# Altium schematic sheet 16gpio_misc.SchDoc
size B
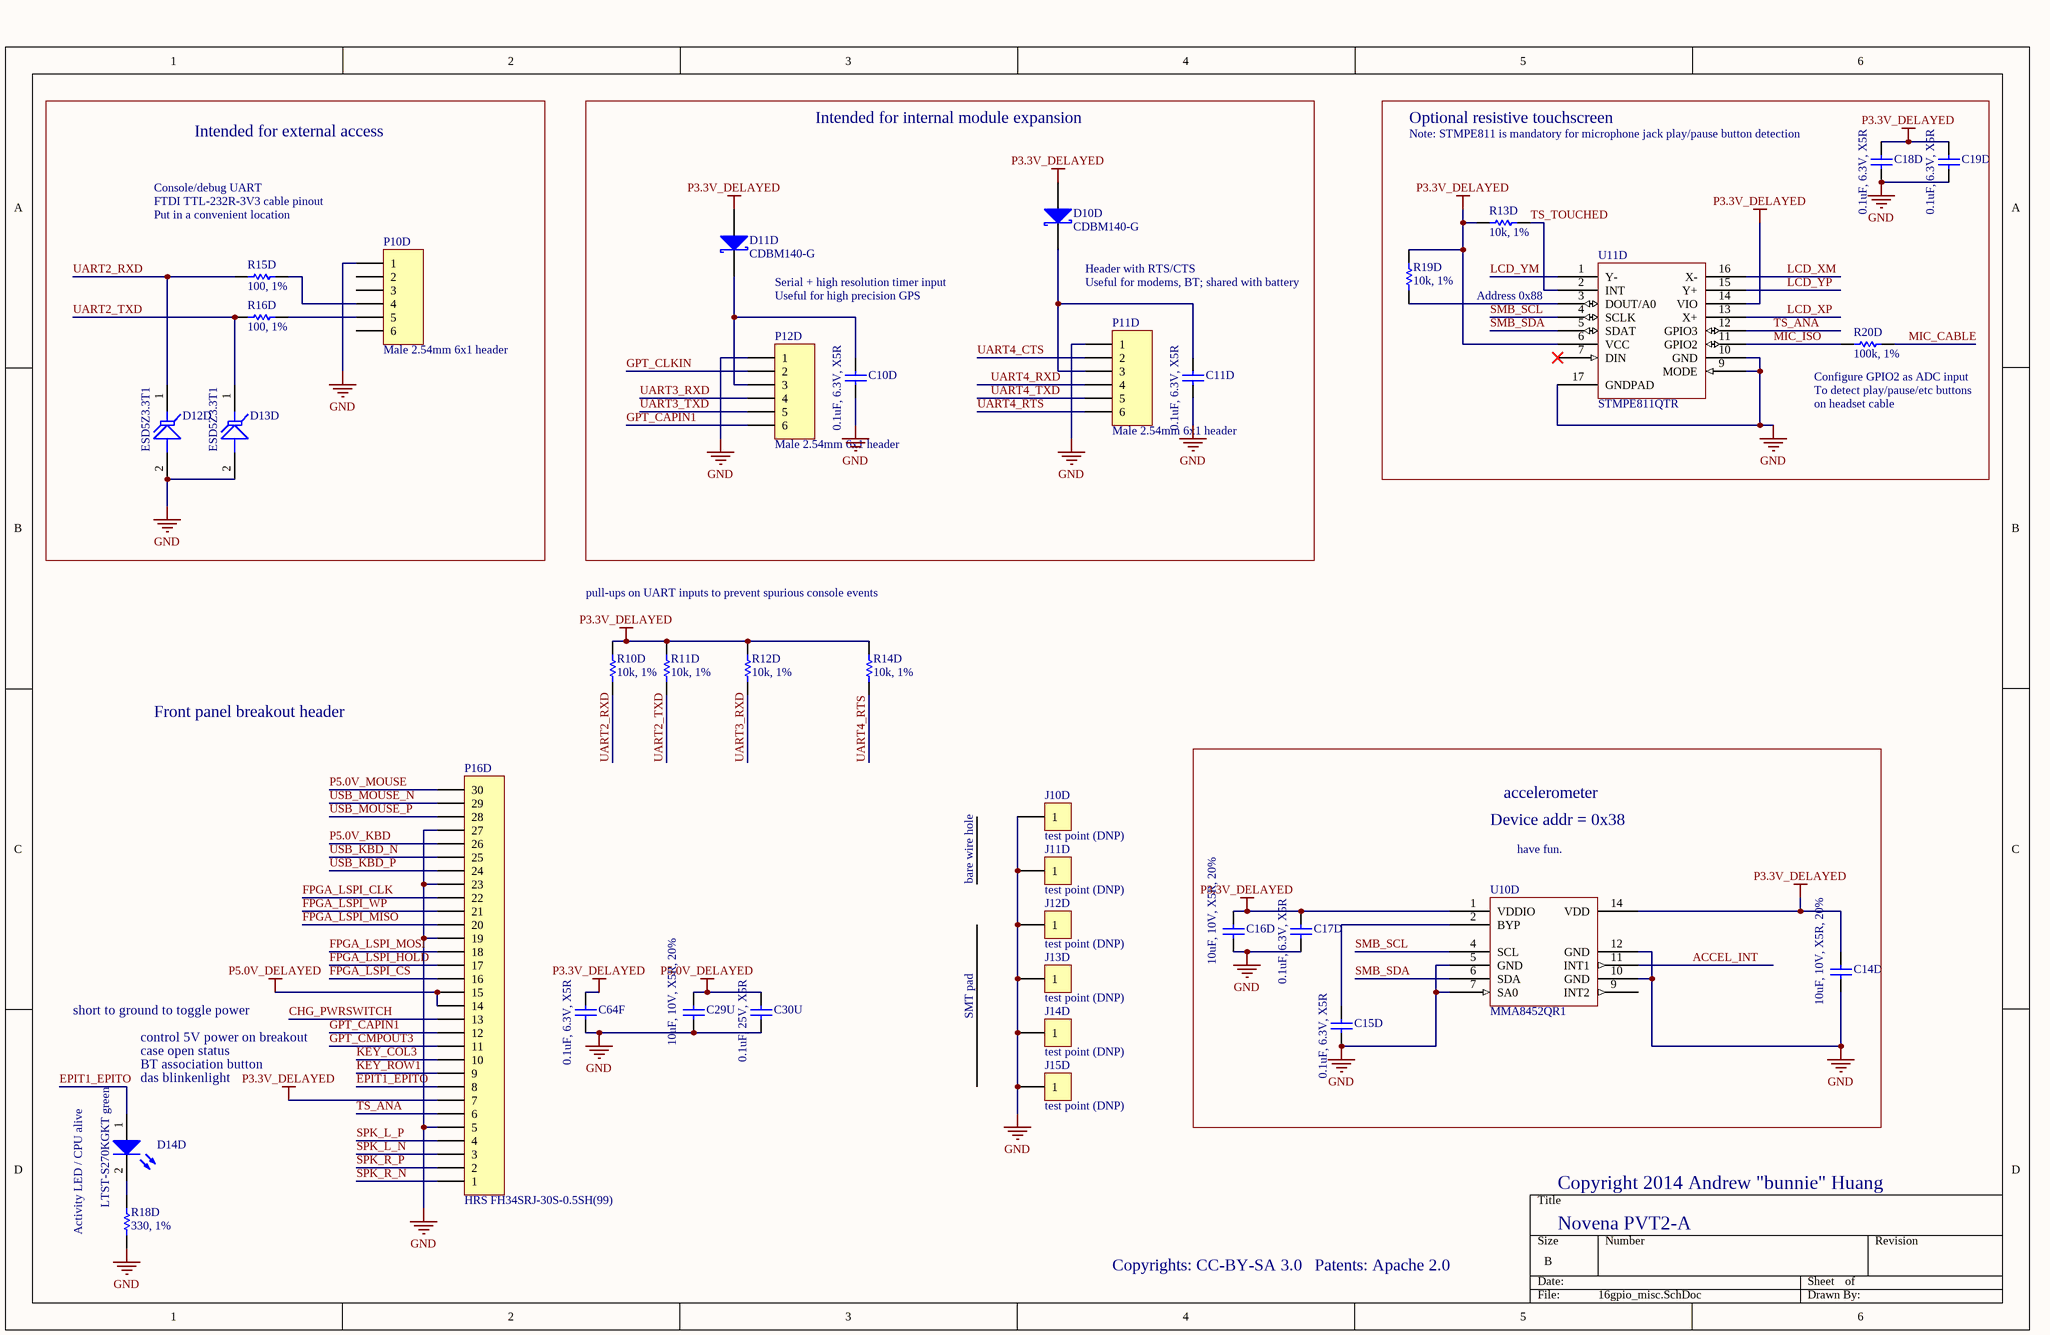
[diagram p0: 16gpio_misc.SchDoc]

## Parts
C10D  0.1uF, 6.3V, X5R  [CAPC0603N_B]
C11D  0.1uF, 6.3V, X5R  [CAPC0603N_B]
C14D  10uF, 10V, X5R, 20%  [CAPC1608N]
C15D  0.1uF, 6.3V, X5R  [CAPC0603N_B]
C16D  10uF, 10V, X5R, 20%  [CAPC1608N]
C17D  0.1uF, 6.3V, X5R  [CAPC0603N_B]
C18D  0.1uF, 6.3V, X5R  [CAPC0603N_B]
C19D  0.1uF, 6.3V, X5R  [CAPC0603N_B]
C29U  10uF, 10V, X5R, 20%  [CAPC1608N]
C30U  0.1uF, 25V, X5R  [CAPC1005N]
C64F  0.1uF, 6.3V, X5R  [CAPC0603N_B]
D10D  CDBM140-G  [SOD123]
D11D  CDBM140-G  [SOD123]
D12D  ESD5Z3.3T1  [SOD-523]
D13D  ESD5Z3.3T1  [SOD-523]
D14D  LTST-S270KGKT green  [CD1608-0603]
J10D  test point (DNP)  [TP_HOLE]
J11D  test point (DNP)  [TP_HOLE]
J12D  test point (DNP)  [TP_SMT_38mil]
J13D  test point (DNP)  [TP_SMT_38mil]
J14D  test point (DNP)  [TP_SMT_38mil]
J15D  test point (DNP)  [TP_SMT_38mil]
P10D  Male 2.54mm 6x1 header  [HDR1X6]
P11D  Male 2.54mm 6x1 header  [HDR1X6]
P12D  Male 2.54mm 6x1 header  [HDR1X6]
P16D  HRS FH34SRJ-30S-0.5SH(99)  [HRS_FH34SRJ-30S-0.5SH]
R10D  10k, 1%  [RESC1005N]
R11D  10k, 1%  [RESC1005N]
R12D  10k, 1%  [RESC1005N]
R13D  10k, 1%  [RESC1005N]
R14D  10k, 1%  [RESC1005N]
R15D  100, 1%  [RESC1005N]
R16D  100, 1%  [RESC1005N]
R18D  330, 1%  [RESC1005N]
R19D  10k, 1%  [RESC1005N]
R20D  100k, 1%  [RESC1005N]
U10D  MMA8452QR1  [FSC_QFN_3x3x1_16_2077-02]
U11D  STMPE811QTR  [QFN50P300X300-16V2N]

## Blocks framed on the sheet
Intended for external access: D12D D13D P10D R15D R16D
Intended for internal module expansion: C10D C11D D10D D11D P11D P12D
Optional resistive touchscreen: C18D C19D R13D R19D R20D U11D

## Nets
GND: C10D.2 C11D.2 C14D.2 C15D.2 C16D.2 C17D.2 C18D.2 C19D.2 C29U.2 C30U.2 C64F.2 D12D.2(A) D13D.2(A) J10D.1 J11D.1 J12D.1 J13D.1 J14D.1 J15D.1 P10D.1 P11D.1 P12D.1 P16D.5 P16D.19 P16D.23 P16D.27 R18D.1 U10D.5(GND) U10D.7(SA0) U10D.10(GND) U10D.12(GND) U11D.9(MODE) U11D.10(GND) U11D.17(GNDPAD)
P3.3V_DELAYED: C14D.1 C16D.1 C17D.1 C18D.1 C19D.1 C64F.1 D10D.1(A) D11D.1(A) P16D.7 R10D.1 R11D.1 R12D.1 R13D.2 R14D.1 R19D.1 U10D.1(VDDIO) U10D.14(VDD) U11D.6(VCC) U11D.14(VIO)
P5.0V_DELAYED: C29U.1 C30U.1 P16D.14 P16D.15
ACCEL_INT: U10D.11(INT1)
CHG_PWRSWITCH: P16D.13
EPIT1_EPITO: D14D.1(A) P16D.8
FPGA_LSPI_CLK: P16D.22
FPGA_LSPI_CS: P16D.16
FPGA_LSPI_HOLD: P16D.17
FPGA_LSPI_MISO: P16D.20
FPGA_LSPI_MOSI: P16D.18
FPGA_LSPI_WP: P16D.21
GPT_CAPIN1: P12D.6 P16D.12
GPT_CLKIN: P12D.2
GPT_CMPOUT3: P16D.11
KEY_COL3: P16D.10
KEY_ROW1: P16D.9
LCD_XM: U11D.16(X-)
LCD_XP: U11D.13(X+)
LCD_YM: U11D.1(Y-)
LCD_YP: U11D.15(Y+)
MIC_CABLE: R20D.2
MIC_ISO: R20D.1 U11D.11(GPIO2)
P5.0V_KBD: P16D.26
P5.0V_MOUSE: P16D.30
SMB_SCL: U10D.4(SCL) U11D.4(SCLK)
SMB_SDA: U10D.6(SDA) U11D.5(SDAT)
SPK_L_N: P16D.3
SPK_L_P: P16D.4
SPK_R_N: P16D.1
SPK_R_P: P16D.2
TS_ANA: P16D.6 U11D.12(GPIO3)
TS_TOUCHED: R13D.1 U11D.2(INT)
UART2_RXD: D12D.1(K) R10D.2 R15D.2
UART2_TXD: D13D.1(K) R11D.2 R16D.2
UART3_RXD: P12D.4 R12D.2
UART3_TXD: P12D.5
UART4_CTS: P11D.2
UART4_RTS: P11D.6 R14D.2
UART4_RXD: P11D.4
UART4_TXD: P11D.5
USB_KBD_N: P16D.25
USB_KBD_P: P16D.24
USB_MOUSE_N: P16D.29
USB_MOUSE_P: P16D.28
NetC10D_1: C10D.1 D11D.2(K) P12D.3
NetC11D_1: C11D.1 D10D.2(K) P11D.3
NetC15D_1: C15D.1 U10D.2(BYP)
NetD14D_2: D14D.2(K) R18D.2
NetP10D_4: P10D.4 R15D.1
NetP10D_5: P10D.5 R16D.1
NetR19D_2: R19D.2 U11D.3(DOUT/A0)

Not connected (* = marked no-connect by the designer): P10D 2 3 6; U10D 9(INT2); U11D 7(DIN)*

## Notes on the sheet
- (near C18D) Note: STMPE811 is mandatory for microphone jack play/pause button detection
- FTDI TTL-232R-3V3 cable pinout
- Console/debug UART
- Put in a convenient location
- Header with RTS/CTS
- Serial + high resolution timer input
- Useful for high precision GPS
- Useful for modems, BT; shared with battery
- Address 0x88
- (near R20D) Configure GPIO2 as ADC input
- (near R20D) To detect play/pause/etc buttons
- on headset cable
- pull-ups on UART inputs to prevent spurious console events
- Front panel breakout header
- accelerometer
- bare wire hole
- Device addr = 0x38
- have fun.
- short to ground to toggle power
- SMT pad
- das blinkenlight
- BT association button
- case open status
- control 5V power on breakout
- Copyright 2014 Andrew "bunnie" Huang
- Activity LED / CPU alive
- Copyrights: CC-BY-SA 3.0
- Patents: Apache 2.0
- Novena PVT2-A

## Library data of the parts
C10D C11D C14D C15D C16D C17D C18D C19D C29U C30U C64F = Cap Semi: Capacitor (Semiconductor SIM Model); Published: 8-Jun-2000; LatestRevisionDate: 17-Jul-2002; LatestRevisionNote: Re-released for DXP Platform.; PackageReference: C1206; Publisher: Altium Limited
D10D D11D = D Schottky: Schottky Diode; Code - JEDEC: DO-214-AA; Published: 8-Jun-2000; Publisher: Altium Limited; Revision: July-2002: Re-released for DXP Platform.
D12D D13D = Tranzorb: On Semi 3.3V standoff TVS diode; Published: 24-Mar-1999; LatestRevisionDate: 17-Jul-2002; LatestRevisionNote: Re-released for DXP Platform.; PackageReference: DO-7; Publisher: Altium Limited
D14D = LED2: Green R/A LED, 0603 package; Published: 8-Jun-2000; LatestRevisionDate: 17-Jul-2002; LatestRevisionNote: Re-released for DXP Platform.; PackageVersion: Feb-2002; PackageReference: 3.2X1.6X1.1; Publisher: Altium Limited
J10D J11D J12D J13D J14D J15D = CON1: Connector
P10D P11D P12D = Header 6: Header, 6-Pin; LatestRevisionDate: 17-Jul-2002; LatestRevisionNote: Re-released for DXP Platform.; Publisher: Altium Limited
P16D = Header 30: Header, 30-Pin; LatestRevisionDate: 17-Jul-2002; LatestRevisionNote: Re-released for DXP Platform.; Publisher: Altium Limited
R10D R11D R12D R13D R14D R15D R16D R18D R19D = Res1: Resistor; Value: 100k; Published: 8-Jun-2000; LatestRevisionDate: 17-Jul-2002; LatestRevisionNote: Re-released for DXP Platform.; PackageReference: AXIAL-0.3; Publisher: Altium Limited
R20D = Res1: Resistor; Published: 8-Jun-2000; LatestRevisionDate: 17-Jul-2002; LatestRevisionNote: Re-released for DXP Platform.; PackageReference: AXIAL-0.3; Publisher: Altium Limited; Value: 100k
U10D = MMA8452QR1: 3-axis, 12-bit/8-bit digital accelerometer
U11D = STMPE610: 4-wire resistive touchscreen controller